# Altium schematic sheet 11_HEATER.SchDoc
size 420 x 297 mm; SheetNumber: 19; SheetTotal: 24
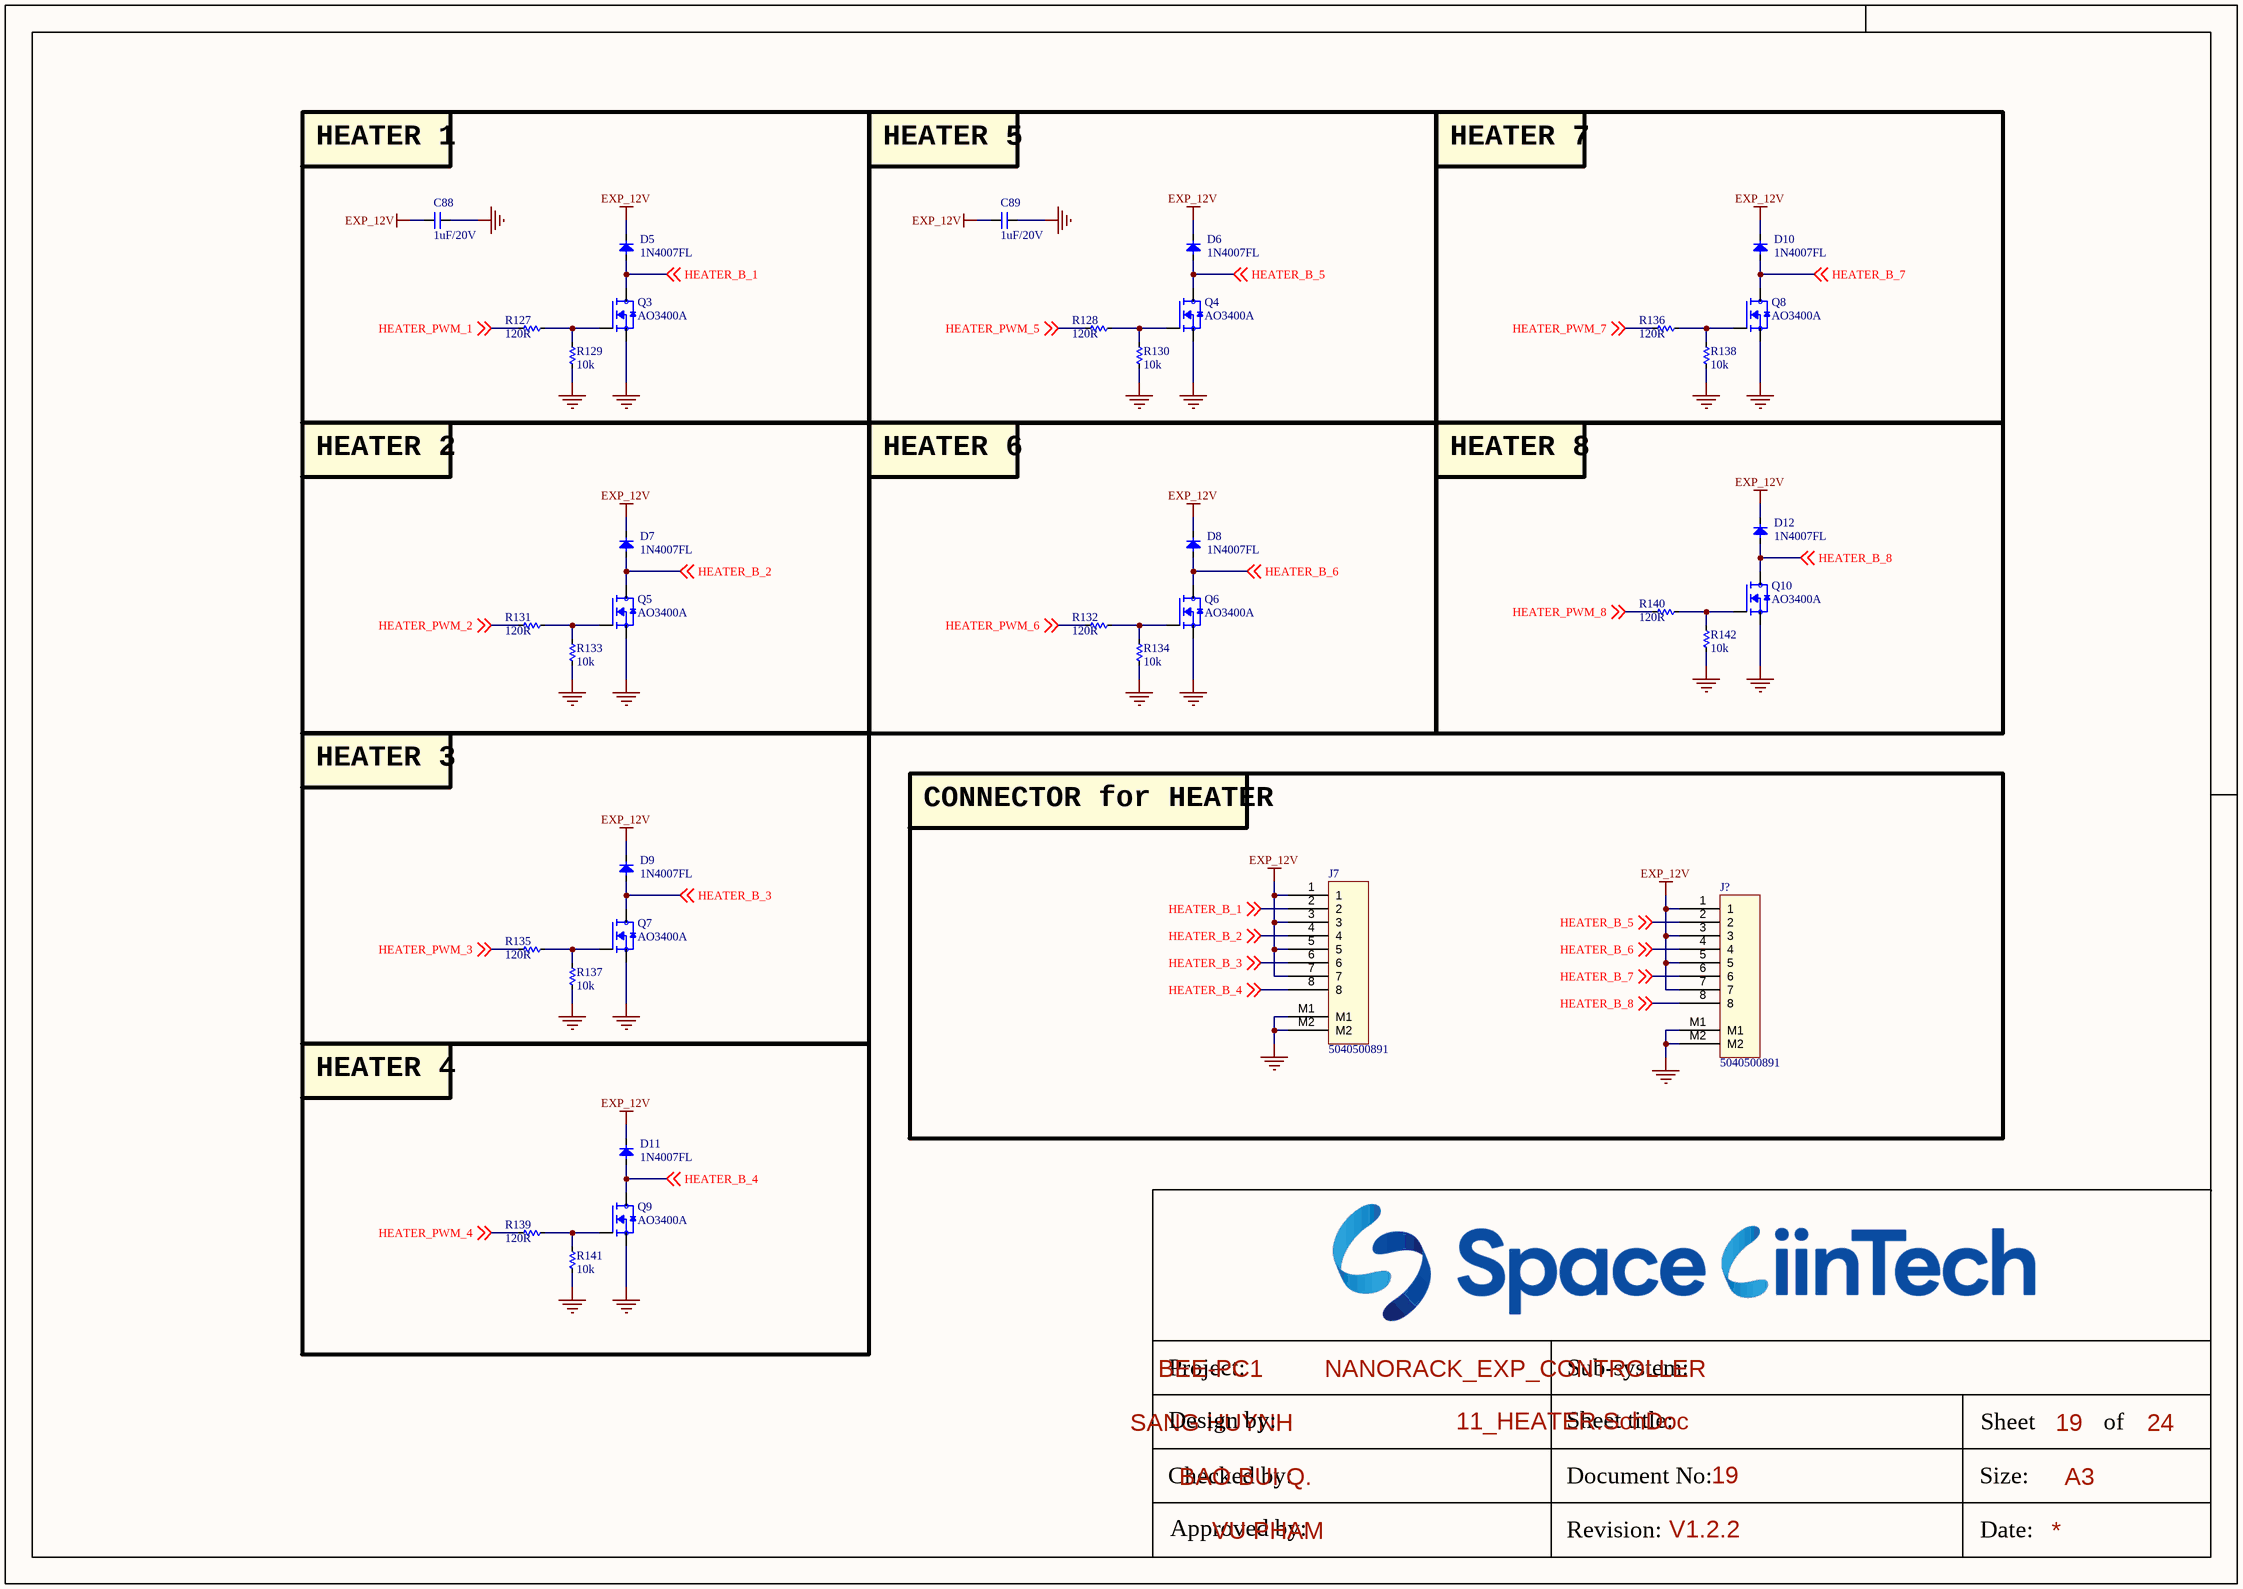
[diagram p0: 11_HEATER.SchDoc]

## Parts
C88  1uF/20V  [CAP_C_1005X60]
C89  1uF/20V  [CAP_C_1005X60]
D5  1N4007FL  [SOD3717X145N]
D6  1N4007FL  [SOD3717X145N]
D7  1N4007FL  [SOD3717X145N]
D8  1N4007FL  [SOD3717X145N]
D9  1N4007FL  [SOD3717X145N]
D10  1N4007FL  [SOD3717X145N]
D11  1N4007FL  [SOD3717X145N]
D12  1N4007FL  [SOD3717X145N]
J7  5040500891  [MOLEX_5040500891]
J?  5040500891  [MOLEX_5040500891]
Q3  AO3400A  [SOT95P240X120-3N]
Q4  AO3400A  [SOT95P240X120-3N]
Q5  AO3400A  [SOT95P240X120-3N]
Q6  AO3400A  [SOT95P240X120-3N]
Q7  AO3400A  [SOT95P240X120-3N]
Q8  AO3400A  [SOT95P240X120-3N]
Q9  AO3400A  [SOT95P240X120-3N]
Q10  AO3400A  [SOT95P240X120-3N]
R127  120R  [RES_C_1005X40]
R128  120R  [RES_C_1005X40]
R129  10k  [RES_C_1005X40]
R130  10k  [RES_C_1005X40]
R131  120R  [RES_C_1005X40]
R132  120R  [RES_C_1005X40]
R133  10k  [RES_C_1005X40]
R134  10k  [RES_C_1005X40]
R135  120R  [RES_C_1005X40]
R136  120R  [RES_C_1005X40]
R137  10k  [RES_C_1005X40]
R138  10k  [RES_C_1005X40]
R139  120R  [RES_C_1005X40]
R140  120R  [RES_C_1005X40]
R141  10k  [RES_C_1005X40]
R142  10k  [RES_C_1005X40]

## Blocks framed on the sheet
HEATER 1: C88 D5 Q3 R127 R129
HEATER 5: C89 D6 Q4 R128 R130
HEATER 7: D10 Q8 R136 R138
HEATER 2: D7 Q5 R131 R133
HEATER 6: D8 Q6 R132 R134
HEATER 8: D12 Q10 R140 R142
HEATER 3: D9 Q7 R135 R137
CONNECTOR for HEATER: J7 J?
HEATER 4: D11 Q9 R139 R141

## Nets
EXP_12V: C88.2 C89.2 D5.1(K) D6.1(K) D7.1(K) D8.1(K) D9.1(K) D10.1(K) D11.1(K) D12.1(K) J7.1 J7.3 J7.5 J7.7 J?.1 J?.3 J?.5 J?.7
GND: C88.1 C89.1 J7.M1 J7.M2 J?.M1 J?.M2 Q3.2(S) Q4.2(S) Q5.2(S) Q6.2(S) Q7.2(S) Q8.2(S) Q9.2(S) Q10.2(S) R129.1 R130.1 R133.1 R134.1 R137.1 R138.1 R141.1 R142.1
HEATER_B_1: D5.2(A) J7.2 Q3.3(D) ; off-sheet HEATER_B_1
HEATER_B_2: D7.2(A) J7.4 Q5.3(D) ; off-sheet HEATER_B_2
HEATER_B_3: D9.2(A) J7.6 Q7.3(D) ; off-sheet HEATER_B_3
HEATER_B_4: D11.2(A) J7.8 Q9.3(D) ; off-sheet HEATER_B_4
HEATER_B_5: D6.2(A) J?.2 Q4.3(D) ; off-sheet HEATER_B_5
HEATER_B_6: D8.2(A) J?.4 Q6.3(D) ; off-sheet HEATER_B_6
HEATER_B_7: D10.2(A) J?.6 Q8.3(D) ; off-sheet HEATER_B_7
HEATER_B_8: D12.2(A) J?.8 Q10.3(D) ; off-sheet HEATER_B_8
HEATER_PWM_1: R127.1 ; off-sheet HEATER_PWM_1
HEATER_PWM_2: R131.1 ; off-sheet HEATER_PWM_2
HEATER_PWM_3: R135.1 ; off-sheet HEATER_PWM_3
HEATER_PWM_4: R139.1 ; off-sheet HEATER_PWM_4
HEATER_PWM_5: R128.1 ; off-sheet HEATER_PWM_5
HEATER_PWM_6: R132.1 ; off-sheet HEATER_PWM_6
HEATER_PWM_7: R136.1 ; off-sheet HEATER_PWM_7
HEATER_PWM_8: R140.1 ; off-sheet HEATER_PWM_8
NetQ3_1: Q3.1(G) R127.2 R129.2
NetQ4_1: Q4.1(G) R128.2 R130.2
NetQ5_1: Q5.1(G) R131.2 R133.2
NetQ6_1: Q6.1(G) R132.2 R134.2
NetQ7_1: Q7.1(G) R135.2 R137.2
NetQ8_1: Q8.1(G) R136.2 R138.2
NetQ9_1: Q9.1(G) R139.2 R141.2
NetQ10_1: Q10.1(G) R140.2 R142.2

## Notes on the sheet
- Project:
- BEE-PC1
- Sub-system:
- NANORACK_EXP_CONTROLLER
- Design by:
- SANG HUYNH
- BAO BUI Q.
- Sheet title:
- Sheet
- A3
- of
- Checked by:
- Approved by:
- VU PHAM
- Revision:
- Document No:
- V1.2.2
- Size:
- Date:

## Library data of the parts
C88 C89 = _CAP_C_2: CAP CHIP
D5-D12 = Diode SMD: Default Diode; Code - JEDEC: DO-214-AB; Value: 1N5007; Published: 8-Jun-2000; Revision: July-2002: Re-released for DXP Platform.; Publisher: Altium Limited
J7 J? = Header 8x1_2M
Q3-Q10 = MOSFET_N: N-Channel 30 V 5.7A (Ta) 1.4W (Ta) Surface Mount SOT-23-3; MF: Alpha & Omega Semiconductor; SnapEDA_Link: https://www.snapeda.com/parts/AO3400A/Alpha/view-part/?ref=snap; Package: SOT-23 Alpha &amp; Omega Semiconductor Inc.; Value: *; MP: AO3400A; Check_prices: https://www.snapeda.com/parts/AO3400A/Alpha/view-part/?ref=eda
R127-R142 = _RES_B_2: RES